# Altium schematic sheet Sheet1 (2).SchDoc
size A4; SheetNumber: 1; SheetTotal: 1; SPICEModelCacheRHASKVOH: <root> / <DocumentId>RHASKVOH</DocumentId> / </root>
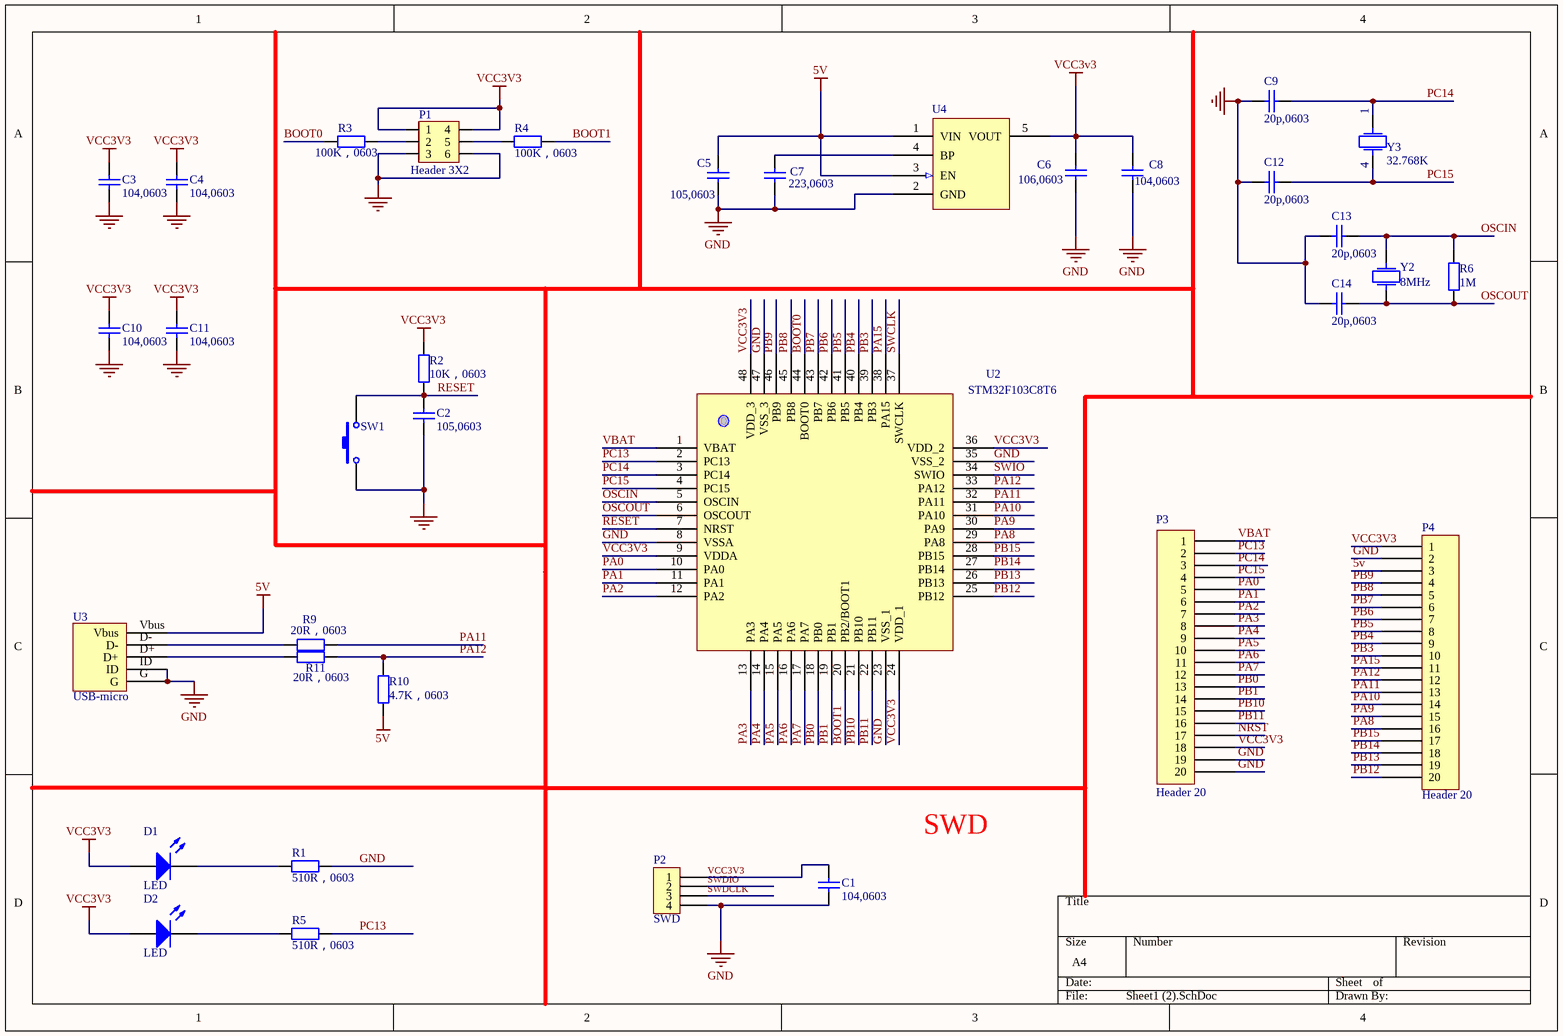
[diagram p0: Sheet1 (2).SchDoc]

## Parts
C1  104,0603  [RAD-0.3]
C2  105,0603  [RAD-0.3]
C3  104,0603  [RAD-0.3]
C4  104,0603  [RAD-0.3]
C5  105,0603  [RAD-0.3]
C6  106,0603  [RAD-0.3]
C7  223,0603  [RAD-0.3]
C8  104,0603  [RAD-0.3]
C9  20p,0603  [RAD-0.3]
C10  104,0603  [RAD-0.3]
C11  104,0603  [RAD-0.3]
C12  20p,0603  [RAD-0.3]
C13  20p,0603  [RAD-0.3]
C14  20p,0603  [RAD-0.3]
D1  LED
D2  LED
Header_3X2  P1  [Header 3X2]
P2  SWD  [SWD]
P3  Header 20  [Header 20]
P4  Header 20  [Header 20]
R1  510R，0603  [AXIAL-0.4]
R2  10K，0603  [AXIAL-0.4]
R3  100K，0603  [AXIAL-0.4]
R4  100K，0603  [AXIAL-0.4]
R5  510R，0603  [AXIAL-0.4]
R6  1M  [AXIAL-0.4]
R9  20R，0603  [AXIAL-0.4]
R10  4.7K，0603  [AXIAL-0.4]
R11  20R，0603  [AXIAL-0.4]
SW1  (no value)  [SPST-2]
U2  STM32F103C8T6  [stm32f103]
U3  USB-micro  [USB-micro]
U4  (no value)  [VIN_OUT]
Y2  F0: 8MHz  (hidden comment: Crystal)
Y3  R: 1  Q: 4  F0: 32.768K  (hidden comment: Crystal)

## Nets
5v: C5.2 P4.?3(3) R10.2 U3.Vbus U4.1(VIN) U4.3(EN)
GND: C1.1 C5.1 C6.1 C7.1 C8.1 P2.?4(4) P3.?19(19) P3.?20(20) P4.?2(2) R1.1 U2.8(VSSA) U2.23(VSS_1) U2.35(VSS_2) U2.47(VSS_3) U3.G U3.ID U4.2(GND)
NetC2_1: C2.1 C3.1 C4.1 C9.2 C10.1 C11.1 C12.2 C13.2 C14.2 Header_3X2.?3(3) Header_3X2.?6(6) SW1.1
VCC3V3: C1.2 C3.2 C4.2 C10.2 C11.2 D1.1(A) D2.1(A) Header_3X2.?1(1) Header_3X2.?4(4) P2.?1(1) P3.?18(18) P4.?1(1) R2.2 U2.9(VDDA) U2.24(VDD_1) U2.36(VDD_2) U2.48(VDD_3)
BOOT0: R3.2 U2.44(BOOT0)
BOOT1: R4.1 U2.20(PB2/BOOT1)
NRST: P3.?17(17)
OSCIN: C13.1 R6.1 U2.5(OSCIN) Y2.2
OSCOUT: C14.1 R6.2 U2.6(OSCOUT) Y2.1
PA0: P3.?5(5) U2.10(PA0)
PA1: P3.?6(6) U2.11(PA1)
PA2: P3.?7(7) U2.12(PA2)
PA3: P3.?8(8) U2.13(PA3)
PA4: P3.?9(9) U2.14(PA4)
PA5: P3.?10(10) U2.15(PA5)
PA6: P3.?11(11) U2.16(PA6)
PA7: P3.?12(12) U2.17(PA7)
PA8: P4.?16(16) U2.29(PA8)
PA9: P4.?15(15) U2.30(PA9)
PA10: P4.?14(14) U2.31(PA10)
PA11: P4.?13(13) R9.1 U2.32(PA11)
PA12: P4.?12(12) R10.1 R11.1 U2.33(PA12)
PA15: P4.?11(11) U2.38(PA15)
PB0: P3.?13(13) U2.18(PB0)
PB1: P3.?14(14) U2.19(PB1)
PB3: P4.?10(10) U2.39(PB3)
PB4: P4.?9(9) U2.40(PB4)
PB5: P4.?8(8) U2.41(PB5)
PB6: P4.?7(7) U2.42(PB6)
PB7: P4.?6(6) U2.43(PB7)
PB8: P4.?5(5) U2.45(PB8)
PB9: P4.?4(4) U2.46(PB9)
PB10: P3.?15(15) U2.21(PB10)
PB11: P3.?16(16) U2.22(PB11)
PB12: P4.?20(20) U2.25(PB12)
PB13: P4.?19(19) U2.26(PB13)
PB14: P4.?18(18) U2.27(PB14)
PB15: P4.?17(17) U2.28(PB15)
PC13: P3.?2(2) R5.1 U2.2(PC13)
PC14: C9.1 P3.?3(3) U2.3(PC14) Y3.2
PC15: C12.1 P3.?4(4) U2.4(PC15) Y3.1
RESET: C2.2 R2.1 SW1.2 U2.7(NRST)
SWCLK: U2.37(SWCLK)
SWDCLK: P2.?3(3)
SWDIO: P2.?2(2)
SWIO: U2.34(SWIO)
VBAT: P3.?1(1) U2.1(VBAT)
NetC6_2: C6.2 C8.2 U4.5(VOUT)
NetC7_2: C7.2 U4.4(BP)
NetD1_2: D1.2(K) R1.2
NetD2_2: D2.2(K) R5.2
NetHeader_3X2_?2: Header_3X2.?2(2) R3.1
NetHeader_3X2_?5: Header_3X2.?5(5) R4.2
NetR9_2: R9.2 U3.D-
NetR11_2: R11.2 U3.D+

## Notes on the sheet
- SWD

## Library data of the parts
C1-C14 = Cap: Capacitor; Published: 8-Jun-2000; LatestRevisionDate: 17-Jul-2002; LatestRevisionNote: Re-released for DXP Platform.; PackageReference: RAD-0.3; Publisher: Altium Limited; PackageDescription: Radial Cap, Thru-Hole; 2 Leads; 0.3 in Pin Spacing
D1 D2 = LED: Light-Emitting Diode; AF: 1; BV: 0; BV_MAX: 1e99; EG: 1.11; FC: 0.5; IBV: 0.001; IS: 1e-14; MJSW: 0.33; NTUN: 30; TNOM: 27; XTI: 3; SimulationGenericComponent: True; CJO: 0; CJP: 0; CTA: 0; CTP: 0; FCS: 0.5; FV_MAX: 1e99; IKF: 0; IKR: 0; ISR: 1e-14; JSW: 0; JTUN: 0; JTUNSW: 0; KEG: 1; KF: 0; LEVEL: 1; N: 1; NBV: 1; NR: 1; NS: 1; PHP: 1; RS: 0; TCV: 0; TLEV: 0; TLEVC: 0; TM1: 0; TM2: 0; TPB: 0; TPHP: 0; TRS: 0; TRS2: 0; TT: 0; TTT1: 0; TTT2: 0; VJ: 1; XTITUN: 3
Header_3X2 = Component_1: null
P3 P4 = Header20
R1-R6 R9-R11 = Res2: Resistor; Published: 8-Jun-2000; LatestRevisionDate: 17-Jul-2002; LatestRevisionNote: Re-released for DXP Platform.; PackageReference: AXIAL-0.4; Publisher: Altium Limited; PackageDescription: Axial Device, Thru-Hole; 2 Leads; 0.4 in Pin Spacing
SW1 = SW-PB: Switch; Published: 24-Mar-1999; LatestRevisionDate: 17-Jul-2002; LatestRevisionNote: Re-released for DXP Platform.; PackageReference: SPST-2; Publisher: Altium Limited; PackageDescription: Switch; 2 Leads
U2 = stm32C8T6
U3 = USB-micro: null
U4 = U3
Y2 = Crystal: R: 500; Q: 50K; SimulationGenericComponent: True
Y3 = Crystal: SimulationGenericComponent: True